# EAGLE design HMMOD-UART-CP2102-USB-V01-002 (EAGLE 9.5.1)
MAPLE-CUx Large Version
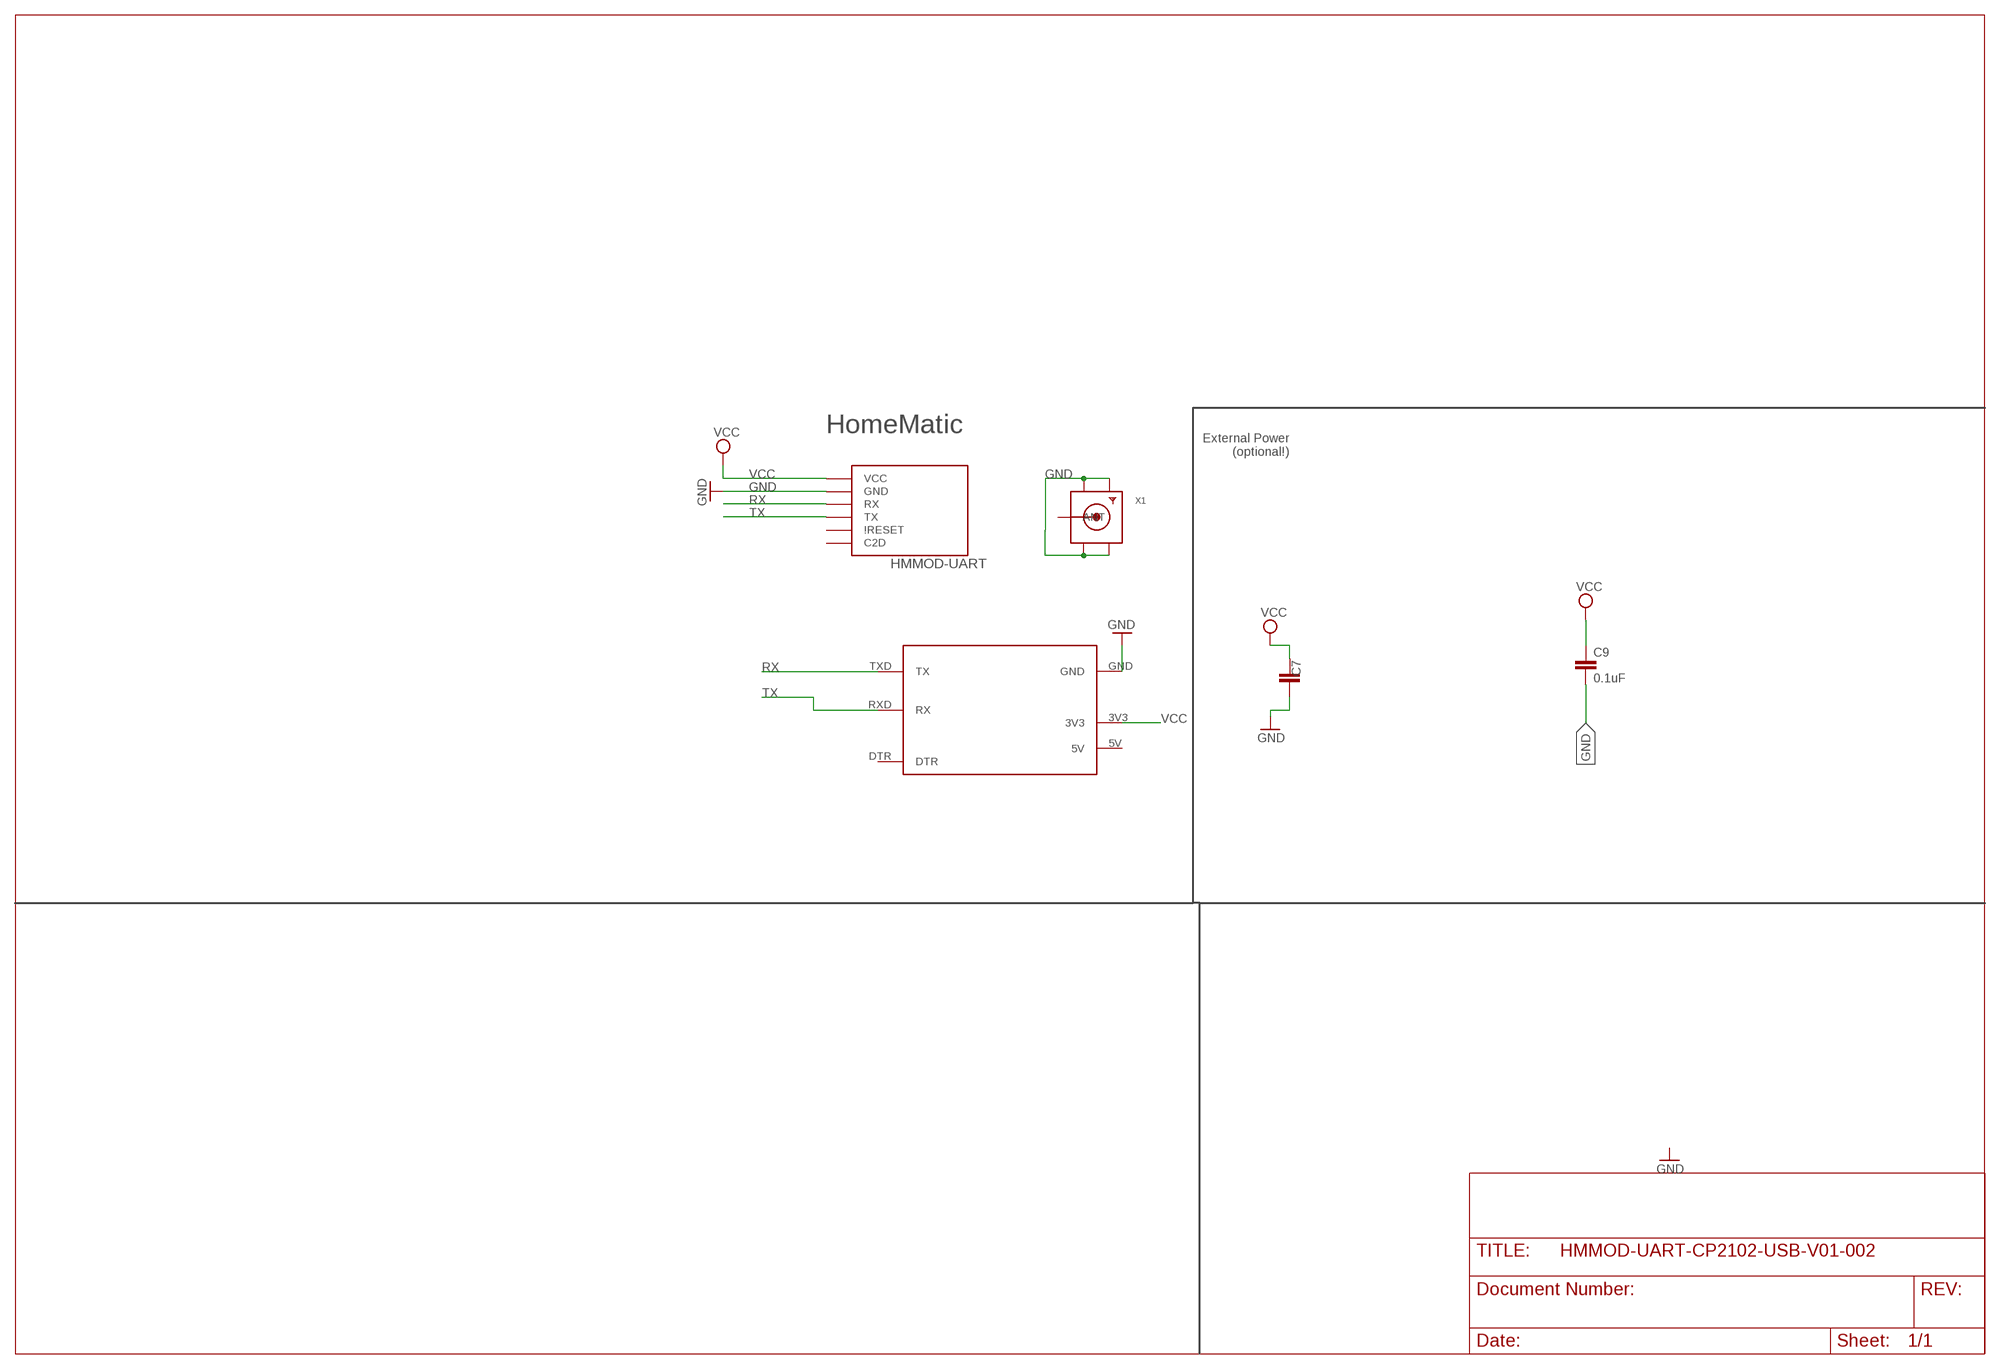
[diagram p0: schematic, sheet 1]

## Parts
C7  C-EUC1812  [C1812]
C9  0.1uF  C-EUC0805  [C0805]
HMMOD-UART  HM-MOD-UARTDIL  [HM-MOD-UART-DIL]
U$1  CP2101  [CP2101-BEAKOUT]
X1  SMACONNECTOR_EDGE  [SMA_EDGELAUNCH]

## Nets
GND [PWR]: C7.1 C9.2 HMMOD-UART.2(GND) U$1.GND X1.GND@1(GND4) X1.GND@2(GND3) X1.GND@3(GND2) X1.GND@4(GND1)
RX: HMMOD-UART.6(RX) U$1.TXD(TX)
TX: HMMOD-UART.5(TX) U$1.RXD(RX)
VCC [PWR]: C7.2 C9.1 HMMOD-UART.1(VCC) U$1.3V3
Unconnected: HMMOD-UART.3(C2D) HMMOD-UART.4(\!RESET) U$1.DTR X1.P(ANT)

## Notes on the sheet
- HomeMatic
- External Power
  (optional!)

## Power pins joined to a net without a drawn wire
5V: U$1.5V

## Library data of the parts
C7 C9 = rcl:C-EU: CAPACITOR, European symbol; SPICEPREFIX: C
HMMOD-UART = wireless:HM-MOD-UART: eQ3 HM-MOD-UART-AW-SH2 wireless module for 868 MHz. DIL version for mounting with pin header (antenna upwards) and SMD variant available (antenna downwards).
U$1 = Martin-USB-V001:CP2101
X1 = adafruit:SMACONNECTOR: SMA Connector 90° DIP SMA Connector, 50 Ohm (4UConnector: 07259)

## Net classes
0 default: width 0.305 mm
1 PWR: width 0.61 mm

## Board
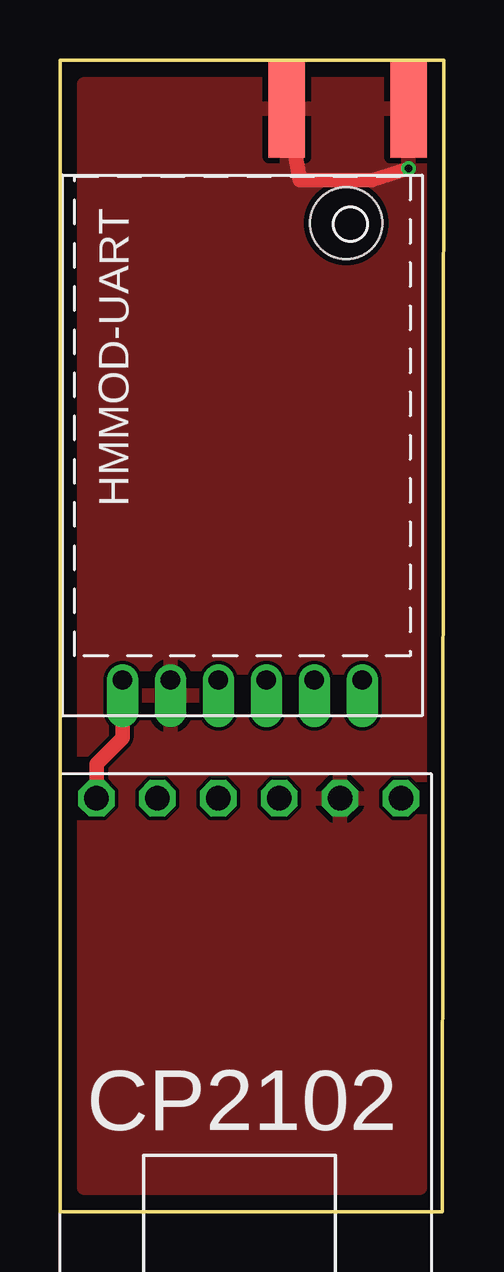
[diagram p1: board, top side]
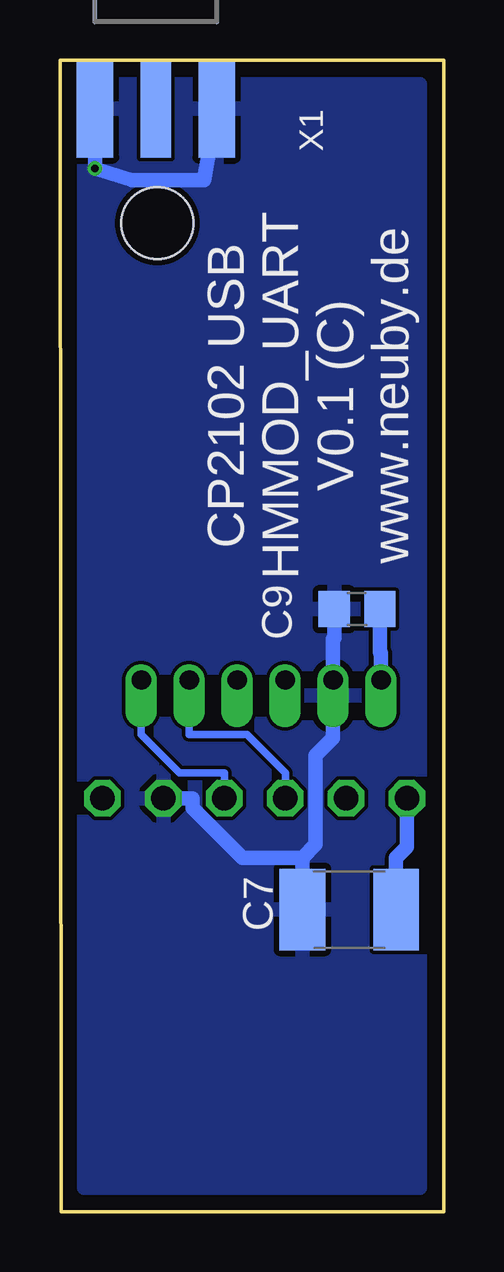
[diagram p2: board, bottom side, seen from below]

Size 16 x 48 mm. Coordinates in mm from the lower left corner, seen from the top.
Outline: 0,0 0,48 16,48 15.94,0 0,0
Copper layers (1*16): Top 0.035mm / dielectric 1.5mm / Bottom 0.035mm
Design rules "SeeedStudio_2layer_DRU_no_angle_20140221": minimum track width 6mil, minimum drill 12mil, track to track 6mil, track to pad 6mil, pad to pad 6mil, via to via 6mil, smd to smd 0mil, copper to edge 10mil, drill to drill 10mil, minimum pad ring 10mil, minimum via ring 6mil, stop-mask expansion 2mil, vias tented up to drill 100mil, thermal gap 10mil
Holes 3 mm at 11.94,41.2

### Footprints (pad centres in the part's own frame; a part is rotated, then mirrored left to right if it is on the bottom)
C1812 = smd 1.9 x 3.4: 1 -1.95,0; 2 1.95,0
C0805 = smd 1.3 x 1.5: 1 -0.95,0; 2 0.95,0
HM-MOD-UART-DIL = drill 0.8 offset: 1 0,12; 2 0,10; 3 0,8; 4 0,6; 5 0,4; 6 0,2
CP2101-BEAKOUT = drill 1.016 octagon: 3V3 13.97,1.016; 5V 1.27,1.016; DTR 11.43,1.016; GND 3.81,1.016; RXD 8.89,1.016; TXD 6.35,1.016
SMA_EDGELAUNCH = smd 4.064 x 1.524: GND@1 2.032,-2.54; GND@2 2.032,2.54 | smd 4.064 x 1.524 bottom: GND@3 2.032,2.54; GND@4 2.032,-2.54 | smd 4.064 x 1.27: P 2.032,0

### Placement (x,y rotation side)
C7  3.94,12.59 0 bottom
C9  3.61,25.11 180 bottom
HMMOD-UART  14.61,22.16 90 top
U$1  15.49,18.24 180 top
X1  12,48 270 bottom

### Tracks (layer width: path | path; a pad name or v marks a point on that pad's centre or on a via)
GND  (via drill 0.3 pad 0.61)
  Top 0.61: v14.54,43.48 13,43 10,43 9.65,44.94 X1.GND@3
  Bottom 0.61: U$1.GND 10.46,17.22 10.46,16.81 8.4,14.74 5.89,14.74 | C7.1 5.89,14.74 | 5.89,14.74 5.33,15.3 5.33,19.01 4.61,19.74 HMMOD-UART.2 4.61,23.86 4.56,23.91 C9.2 | 14.54,44.72 v14.54,43.48 | X1.GND@4 v14.54,43.48 | X1.GND@3 10,43 13,43 v14.54,43.48
  pour Bottom: 1,47 15,47 15,1 1,1
  pour Top: 1,47 15,47 15,1 1,1
RX
  Bottom 0.305: HMMOD-UART.6 12.61,19.89 11,18.29 9.14,18.29 U$1.TXD
TX
  Bottom 0.305: HMMOD-UART.5 10.61,19.89 8.21,19.89 6.6,18.29 U$1.RXD
VCC
  Top 0.61: HMMOD-UART.1 2.6,19.74 1.52,18.66 U$1.3V3
  Bottom 0.61: HMMOD-UART.1 2.6,23.27 2.66,23.33 C9.1 | C7.2 1.99,14.74 1.52,15.21 U$1.3V3

### Text on the board
bNames: CP2102 USB / HMMOD_UART / V0.1 (C) / www.neuby.de